# Altium schematic sheet OR Power Switch.SchDoc
size A4; Organization: TESLA Motors, INC; Address1: 3500 Deer Creek Road; Address2: Palo Alto, CA; Address4: U.S.A.; SheetNumber: 9; SheetTotal: 21
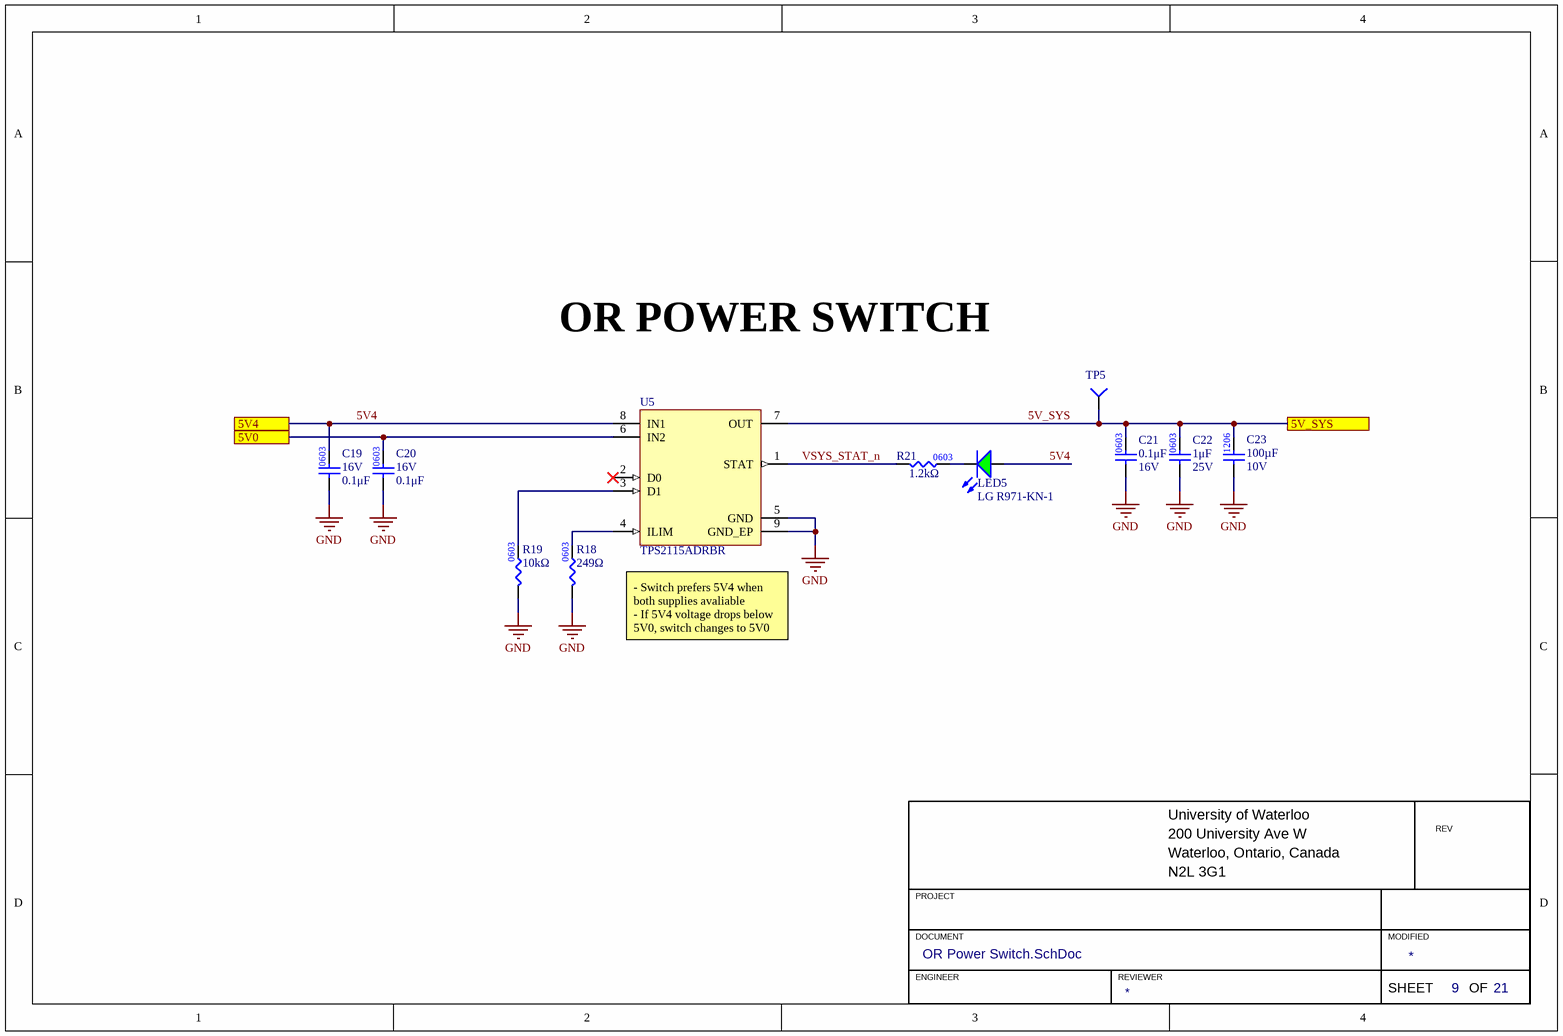
[diagram p0: OR Power Switch.SchDoc]

## Parts
C19  value 0.1μF  Voltage Rating: 16V  [CAP0603]  (hidden comment: CAP_0.1uF_16V_0603)
C20  value 0.1μF  Voltage Rating: 16V  [CAP0603]  (hidden comment: CAP_0.1uF_16V_0603)
C21  value 0.1μF  Voltage Rating: 16V  [CAP0603]  (hidden comment: CAP_0.1uF_16V_0603)
C22  value 1μF  Voltage Rating: 25V  [CAP0603]  (hidden comment: CAP_1uF_25V_0603)
C23  value 100µF  Voltage Rating: 10V  [CAP1206]  (hidden comment: CAP_100uF_10V_0603)
LED5  Manufacturer Part Number 1: LG R971-KN-1  [LED_0805_GREEN]  (hidden comment: LED_GREEN_0805)
R18  value 249Ω  [RES0603]  (hidden comment: RES_249Ω_0603_1%)
R19  value 10kΩ  [RES0603]  (hidden comment: RES_10kΩ_0603_1%)
R21  value 1.2kΩ  [RES0603]  (hidden comment: RES_1.2kΩ_0603_1%)
TP5  TESTPOINT_KEYSTONE_LOOP  [KEYSTONE_5019]  (value not drawn)
U5  TPS2115ADRBR  [TI_8-VSON]

## Ports
5V0, 5V4, 5V_SYS

## Nets
GND: C19.1 C20.1 C21.1 C22.1 C23.1 R18.1 R19.1 U5.5(GND) U5.9(GND_EP)
5V0: C20.2 U5.6(IN2) ; port 5V0
5V4: C19.2 LED5.1(A) U5.8(IN1) ; port 5V4
5V_SYS: C21.2 C22.2 C23.2 TP5.1(=value) U5.7(OUT) ; port 5V_SYS
VSYS_STAT_n: R21.1 U5.1(STAT)
NetLED5_2: LED5.2(K) R21.2
NetR18_2: R18.2 U5.4(ILIM)
NetR19_2: R19.2 U5.3(D1)

Not connected (* = marked no-connect by the designer): U5 2(D0)*

## Notes on the sheet
- OR POWER SWITCH
- - Switch prefers 5V4 when both supplies avaliable
  - If 5V4 voltage drops below 5V0, switch changes to 5V0
- University of Waterloo
- 200 University Ave W
- REV
- PROJECT
- Waterloo, Ontario, Canada
- N2L 3G1
- DOCUMENT
- ENGINEER
- REVIEWER
- MODIFIED
- SHEET
- OF
- (in symbol RES_249Ω_0603_1%) 0603

## Library data of the parts
C19-C21 = CAP_0.1uF_16V_0603: CAP CER 0.1UF 16V X7R 0603; Manufacturer Part Number 1: CC0603KRX7R7BB104; Manufacturer 1: Yageo; Package: 0603; Supplier Part Number 1: 311-1088-1-ND; Supplier 1: Digi-Key; Dielectric: X7R
C22 = CAP_1uF_25V_0603: CAP CER 1UF 25V X5R 0603; Manufacturer 1: Samsung; Manufacturer Part Number 1: CL10A105KA8NNNC; Supplier 1: Digi-Key; Mounting Type: SMD; Package: 0603; Supplier Part Number 1: 1276-1102-1-ND; Dielectric: X5R
C23 = CAP_100uF_10V_0603: CAP CER 100UF 10V X5R 1206; Manufacturer 1: Murata Electronics; Manufacturer Part Number 1: GRM31CR61A107MEA8L; Package/Footprint: 1206; Mounting Type: SMD; Dielectric: X5R; Supplier 1: Digi-Key; Supplier Part Number 1: 490-GRM31CR61A107MEA8LCT-ND
LED5 = LED_GREEN_0805: LED GREEN DIFFUSED 0805 SMD; Manufacturer 1: OSRAM; Forward Voltage Drop: 2.2V; Package/Footprint: 0805; Supplier Part Number 1: 475-1410-1-ND; Supplier 1: Digi-Key; Mounting Type: SMD
R18 = RES_249Ω_0603_1%: RES 249 OHM 1% 1/10W 0603; Manufacturer 1: YAGEO; Manufacturer Part Number 1: RC0603FR-07249RL; Supplier Part Number 1: 311-249HRCT-ND; Supplier 1: Digi-Key
R19 = RES_10kΩ_0603_1%: RES 10K OHM 1% 1/8W 0603; Manufacturer 1: Stackpole Electronics Inc; Manufacturer Part Number 1: RNCP0603FTD10K0; Supplier Part Number 1: RNCP0603FTD10K0CT-ND; Supplier 1: Digi-Key; Mounting Type: SMD; Package: 0603
R21 = RES_1.2kΩ_0603_1%: RES 1.2K OHM 1% 1/10W 0603; Manufacturer 1: Yageo; Manufacturer Part Number 1: RC0603FR-071K2L; Supplier Part Number 1: 311-1.20KHRCT-ND; Supplier 1: Digi-Key; Package: 0603
TP5 = TESTPOINT_KEYSTONE_LOOP: PC TEST POINT MINIATURE; Manufacturer 1: Keystone Electronics; Manufacturer Part Number 1: 5019; Package/Footprint: SMD; Supplier 1: Digi-Key; Mounting Type: SMD; Supplier Part Number 1: 36-5019CT-ND
U5 = TPS2115ADRBR: IC OR CTRLR SRC SELECT 8SON; Manufacturer 1: Texas Instruments; Package/Footprint: 8-VDFN; Manufacturer Part Number 1: TPS2115ADRBR; Supplier 1: Digikey; Supplier Part Number 1: 296-23394-1-ND